# EAGLE schematic Sensor (EAGLE 7.0.0)
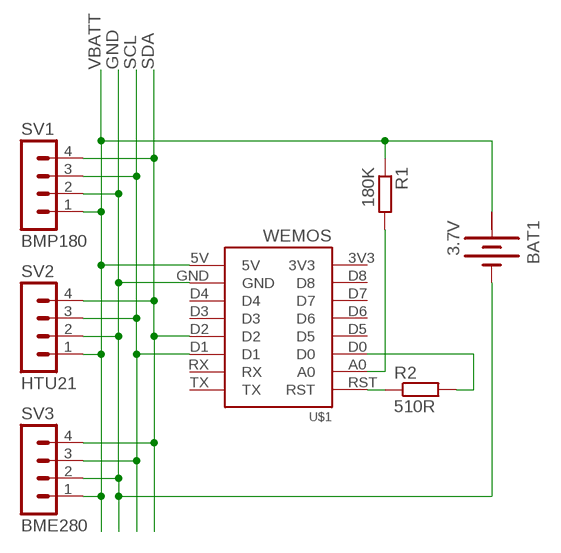
[diagram p0: schematic, sheet 1]

## Parts
BAT1  3.7V  BATTERY  [BATTERY]
R1  180K  R-EU_0204/5  [0204/5]
R2  510R  R-EU_0204/5  [0204/5]
SV1  BMP180  MA04-1  [MA04-1]
SV2  HTU21  MA04-1  [MA04-1]
SV3  BME280  MA04-1  [MA04-1]
U$1  WEMOS  [WEMOS]

## Nets
GND: BAT1.- SV1.2 SV2.2 SV3.2 U$1.GND
N$1: R2.1 U$1.RST
N$2: R2.2 U$1.D0
N$3: R1.2 U$1.A0
SCL: SV1.3 SV2.3 SV3.3 U$1.D1
SDA: SV1.4 SV2.4 SV3.4 U$1.D2
VBATT: BAT1.+ R1.1 SV1.1 SV2.1 SV3.1 U$1.5V
Unconnected: U$1.3V3 U$1.D3 U$1.D4 U$1.D5 U$1.D6 U$1.D7 U$1.D8 U$1.RX U$1.TX

## Power pins joined to a net without a drawn wire
+: BAT1.+@1(+)

## Library data of the parts
BAT1 = special:BATTERY: BATTERY
R1 R2 = rcl:R-EU_: RESISTOR, European symbol
SV1-SV3 = con-lstb:MA04-1: PIN HEADER; OC_FARNELL: unknown; OC_NEWARK: unknown
U$1 = 1455413453956-wemos:WEMOS